# Altium schematic sheet Sheet1.SchDoc
size A4
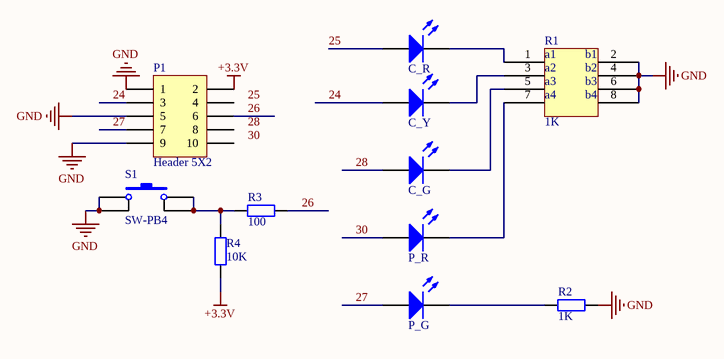
[diagram p0: Sheet1.SchDoc]

## Parts
C_G  LED0  [LED_0805]  (value not drawn)
C_R  LED0  [LED_0805]  (value not drawn)
C_Y  LED0  [LED_0805]  (value not drawn)
P1  Header 5X2  [HDR5X2_A1]
P_G  LED0  [LED_0805]  (value not drawn)
P_R  LED0  [LED_0805]  (value not drawn)
R1  1K  [8P4R_0603]
R2  value 1K  [0805-2]  (hidden comment: Res1)
R3  value 100  [0805-2]  (hidden comment: Res1)
R4  value 10K  [0805-2]  (hidden comment: Res1)
S1  SW-PB4  [SW_PB4_A1]

## Nets
+3.3V: P1.2 R4.1
GND: P1.1 P1.5 P1.9 R1.2 R1.4 R1.6 R1.8 R2.2 S1.1 S1.4
24: C_Y.1(A) P1.3
25: C_R.1(A)
26: P1.6 R3.1
27: P1.7 P_G.1(A)
28: C_G.1(A)
30: P_R.1(A)
NetC_G_2: C_G.2(K) R1.5
NetC_R_2: C_R.2(K) R1.1
NetC_Y_2: C_Y.2(K) R1.3
NetP_G_2: P_G.2(K) R2.1
NetP_R_2: P_R.2(K) R1.7
NetR3_2: R3.2 R4.2 S1.2 S1.3

Not connected (* = marked no-connect by the designer): P1 4 8 10

## Notes on the sheet
- Labels drawn without touching a wire or pin: 25, 28, 30
- (in symbol res_8p4r) a1; b1; a2; b2; a3; b3; a4; b4

## Library data of the parts
C_G C_R C_Y P_G P_R = LED0: 发光二极管; Published: 8-Jun-2000; LatestRevisionDate: 08-Jul-2005; LatestRevisionNote: Mech Layer 1 removed.; PackageReference: LED-0; Publisher: Altium Limited
P1 = Header 5X2: 接插件; LatestRevisionDate: 17-Jul-2002; LatestRevisionNote: Re-released for DXP Platform.; Publisher: Altium Limited
R1 = res_8p4r
R2-R4 = Res1: 贴片电阻; Published: 8-Jun-2000; LatestRevisionDate: 17-Jul-2002; LatestRevisionNote: Re-released for DXP Platform.; PackageReference: AXIAL-0.4; Publisher: Altium Limited
S1 = SW-PB4: 微动开关; Published: 24-Mar-1999; LatestRevisionDate: 17-Jul-2002; LatestRevisionNote: Re-released for DXP Platform.; PackageReference: SPST-2; Publisher: Altium Limited